# Altium project TIDA-PowerNBIoT.PrjPcb (part 1 of 2)
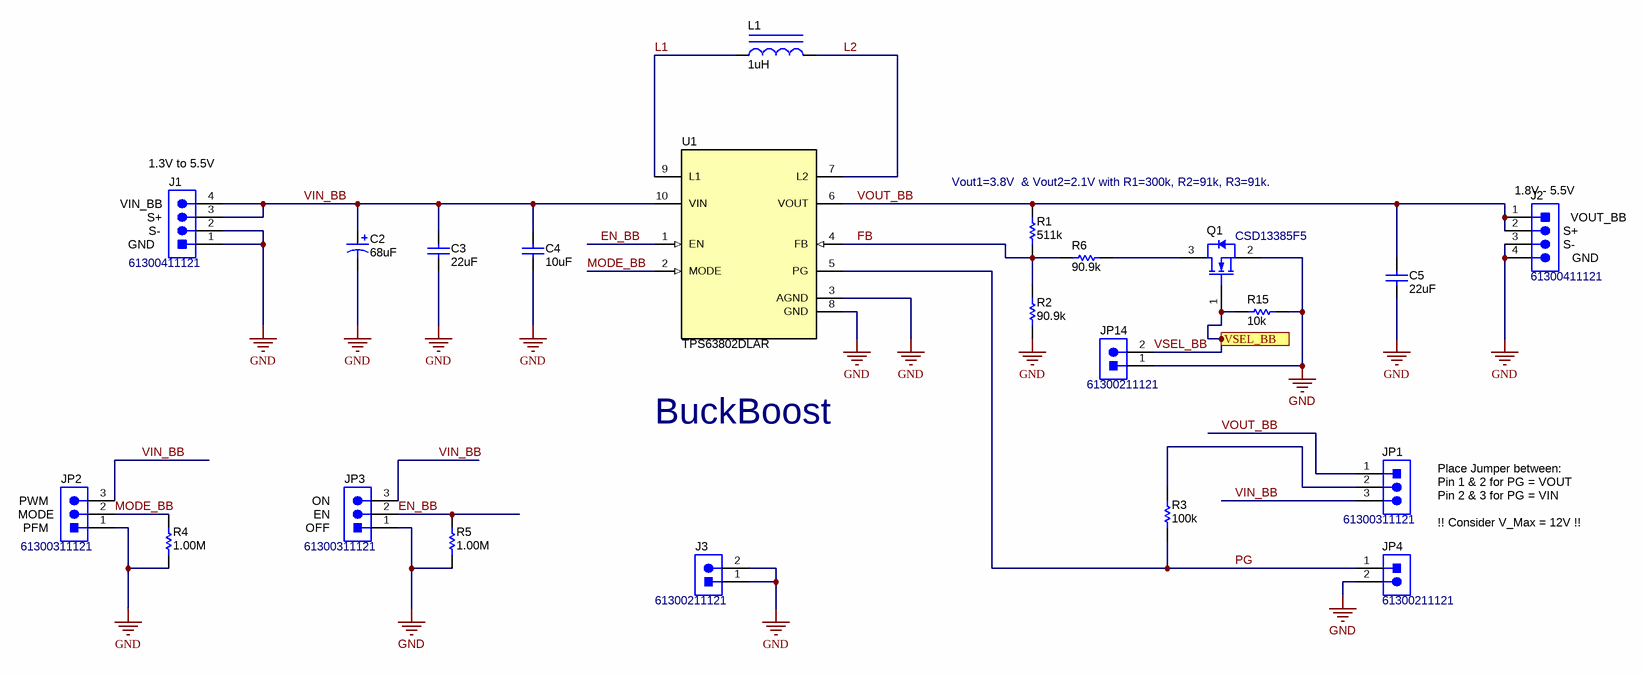
[diagram p0: TIDA-PowerNB_BuckBoost.SchDoc]
CopyrightYear: 2018; EVM_orderable: shippable; EVM_Sheet Title: 12; PCB_Layout: a0797195; PCB_Rev: E1; PRJ_Customer: Public Release; PRJ_Engineer: MGS; PRJ_Number: TIDA-010053; PRJ_Title: TIDA-PowerNBIoT; SCH_Rev: E1; Size: A; TechSupport: http://www.ti.com/support; TID: TIDA-010053
5 sheets, 83 parts. Net scope: flat (ports and power ports of the same name join across sheets).
Board file: TIDA-PowerNBIoT_PCB.PcbDoc
Sheets:
  TIDA-PowerNB_BuckBoost.SchDoc
  TIDA-PowerNBIoT_Buck.SchDoc
  TIDA-PowerNBIoT_CoverSheet.SchDoc
  TIDA-PowerNBIoT_Boost.SchDoc
  TIDA-PowerNBIoT_EVM_Hardware.SchDoc

## Sheet TIDA-PowerNB_BuckBoost.SchDoc
size A3; Date: Not shown in title block; ApprovedBy: Not shown in title block; CheckedBy: Not shown in title block; Author: Not shown in title block; CompanyName: Not shown in title block; DrawnBy: Julian Hagedorn; Engineer: Not shown in title block; Organization: Not shown in title block; Address1: Not shown in title block; Address2: Not shown in title block; Address3: Not shown in title block; Address4: Not shown in title block; DocumentNumber: 1; Revision: Use project parameter SCH_Rev; SheetNumber: 1; SheetTotal: 2; PageSetup: Record=PageOptions|CenterHorizontal=True|CenterVertical=True|PrintScale=1.00|XCorrection=1.00|YCorrection=1.00|PrintKind=0|BorderSize=5000000|LeftOffset=0|BottomOffset=0|Orientation=2|PaperLength=1000|PaperWidth=1000|Scale=100|PaperSource=15|PrintQuality=600|MediaType=1|DitherType=10|PaperKind=Letter|PrintScaleMode=1; CurrentTime: Not shown in title block; CurrentDate: Not shown in title block; Time: Not shown in title block; DocumentFullPathAndName: Not shown in title block; DocumentName: Not shown in title block; ModifiedDate: Not shown in title block; ImagePath: Not shown in title block

### Parts
C2  ValueDisplayed: 68uF  [7343-31]  (hidden comment: Cap_Polarized)
C3  ValueDisplayed: 22uF  [1206_190]  (hidden comment: Capacitor)
C4  ValueDisplayed: 10uF  [0603S]  (hidden comment: Capacitor)
C5  ValueDisplayed: 22uF  [0603S]  (hidden comment: Capacitor)
J1  61300411121  [WURTH_61300411121]
J2  61300411121  [WURTH_61300411121]
J3  61300211121  [WURTH_61300211121]
JP1  61300311121  [WURTH_61300311121]
JP2  61300311121  [WURTH_61300311121]
JP3  61300311121  [WURTH_61300311121]
JP4  61300211121  [WURTH_61300211121]
JP14  61300211121  [WURTH_61300211121]
L1  ValueDisplayed: 1uH  [WE-MAPI_4020]  (hidden comment: 74438356010)
Q1  CSD13385F5  [YJK0003A]
R1  ValueDisplayed: 511k  [0402]  (hidden comment: CRCW0402511KFKED)
R2  ValueDisplayed: 90.9k  [0402]  (hidden comment: CRCW040290K9FKED)
R3  ValueDisplayed: 100k  [0402]  (hidden comment: RC0402FR-07100KL)
R4  ValueDisplayed: 1.00M  [0402]  (hidden comment: CRCW04021M00FKED)
R5  ValueDisplayed: 1.00M  [0402]  (hidden comment: CRCW04021M00FKED)
R6  ValueDisplayed: 90.9k  [0402]  (hidden comment: CRCW040290K9FKED)
R15  Res_ohm: 10k  [0402]  (hidden comment: ERJ-2RKF1002X)
U1  TPS63802DLAR  [DLA0010A]

### Ports
VSEL_BB

### Nets
GND: C2.2(-) C3.2 C4.2 C5.2 J1.1 J1.2 J2.3 J2.4 J3.1 J3.2 JP2.1 JP3.1 JP4.2 JP14.1 Q1.2(S) R2.1 R4.1 R5.1 R15.1 U1.3(AGND) U1.8(GND)
EN_BB: JP3.2 R5.2 U1.1(EN)
FB: R1.1 R2.2 R6.2 U1.4(FB)
L1: L1.1 U1.9(L1)
L2: L1.2 U1.7(L2)
MODE_BB: JP2.2 R4.2 U1.2(MODE)
PG: JP4.1 R3.1 U1.5(PG)
VIN_BB: C2.1(+) C3.1 C4.1 J1.3 J1.4 JP1.3 JP2.3 JP3.3 U1.10(VIN)
VOUT_BB: C5.1 J2.1 J2.2 JP1.1 R1.2 U1.6(VOUT)
VSEL_BB: JP14.2 Q1.1(G) R15.2 ; port VSEL_BB
NetJP1_2: JP1.2 R3.2
NetQ1_3: Q1.3(D) R6.1

### Notes on the sheet
- (near J1) 1.3V to 5.5V
- (near J1) VIN_BB
- (near J1) S+
- (near J1) S-
- (near R1) Vout1=3.8V  & Vout2=2.1V with R1=300k, R2=91k, R3=91k.
- (near J2) 1.8V - 5.5V
- (near J2) S+
- (near J2) VOUT_BB
- (near J1) GND
- (near J2) S-
- (near J2) GND
- BuckBoost
- (near JP2) PWM
- (near JP3) ON
- (near JP2) PFM
- (near JP2) MODE
- (near JP3) OFF
- (near JP3) EN
- Place Jumper between:
  Pin 1 & 2 for PG = VOUT
  Pin 2 & 3 for PG = VIN
  !! Consider V_Max = 12V !!
- Drawn By:
- SVN Rev:
- Number:
- TID #:
- Orderable:
- Rev:
- Sheet Title:
- File:
- Project Title:
- Designed for:
- Assembly Variant:
- Mod. Date:
- Sheet:
- Size:
- of
- A3
- http://www.ti.com
- Texas Instruments and/or its licensors do not warrant the accuracy or completeness of this specification or any information contained therein. Texas Instruments and/or its licensors do not warrant that this design will meet the specifications, will be suitable for your application or fit for any particular purpose, or will operate in an implementation. Texas Instruments and/or its licensors do not warrant that the design is production worthy. You should completely validate and test your design implementation to confirm the system functionality for your application.
- Engineer:
- Contact:
- © Texas Instruments

### Library data of the parts
C2 = CMP-0011790-2: CAP, TA, 68 uF, 20 V, +/- 10%, 0.15 ohm, SMD; PartNumber: T495D686K020ATE150; Manufacturer: Kemet; Polarized: Y; CompType: Capacitor; Value: 68uF; U/M: EA; Cap_F: 68µF; VDC_V: 20V; ESR_ohm: 1.5d; IRMS_A: 9dA; TaMin_C: -55°C; TaMax_C: 125°C; Cap_Case: D; AEC Category: Q200; SizeArea_mm2: 31.39; SizeAreaWB_mm2: 58.59; SizeX_mm: 7.3; SizeY_mm: 4.3; SizeZ_mm: 3.1; PackageReference: 7343-31; RoHS: Y; Tolerance_%: 10%; Value1: 0.15 ohm; Value2: 20V; MountType: SMT; Technology: TA; Series: T495; Publisher: Texas Instruments; LatestRevisionDate: 2017-03-09; LatestRevisionNote: Updated supplier links; ComponentLink1Description: Datasheet link; ComponentLink1URL: http://www.kemet.com/Lists/ProductCatalog/Attachments/261/KEM_T2009_T495.pdf; Supplier 1: Digi-Key; Supplier Part Number 1: 399-3890-1-ND; Supplier 2: Newark; Supplier Part Number 2: 40K1101; Supplier 3: Mouser; Supplier Part Number 3: 80-T495D686K20ATE150; AEC Qualified: ?
C3 = CMP-0009024-2: CAP, CERM, 22 uF, 25 V, +/- 20%, X5R, 1206_190; PartNumber: TMK316BBJ226ML-T; Manufacturer: Taiyo Yuden; Polarized: N; Value: 22uF; U/M: EA; Cap_F: 22µF; Value1: Unknown; VDC_V: 25V; TaMin_C: -55°C; TaMax_C: 85°C; Cap_Case: 1206; AEC Category: Q200; SizeArea_mm2: 5.12; SizeAreaWB_mm2: 10.92; SizeX_mm: 3.2; SizeY_mm: 1.6; SizeZ_mm: 1.9; CompType: Capacitor; PackageReference: 1206_190; RoHS: Y; Tolerance_%: 20%; Value2: 25V; MountType: SMT; Technology: Ceramic; TempCo: X5R; Published: 2008-06-19; Publisher: Texas Instruments; LatestRevisionDate: 2017-03-09; ComponentLink1Description: Datasheet link; ComponentLink1URL: http://www.yuden.co.jp/productdata/catalog/en/mlcc_all_e.pdf; Supplier 1: Digi-Key; Supplier Part Number 1: 587-3246-1-ND; Supplier 2: Newark; Supplier Part Number 2: 29X1397; Supplier 3: Mouser; Supplier Part Number 3: 963-TMK316BBJ226ML-T; AEC Grade: N/A; AEC Qualified: N
C4 = CMP-0007304-5: CAP, CERM, 10 uF, 6.3 V, +/- 20%, X5R, 0603; PartNumber: GRM188R60J106ME84; Manufacturer: MuRata; Polarized: N; Value: 10uF; U/M: EA; Cap_F: 10µF; Value1: Unknown; VDC_V: 6.3V; TaMin_C: -55°C; TaMax_C: 85°C; Cap_Case: 0603; SizeArea_mm2: 1.28; SizeAreaWB_mm2: 4.68; SizeX_mm: 1.6; SizeY_mm: 0.8; SizeZ_mm: 1; AEC Category: Q200; CompType: Capacitor; PackageReference: 0603; RoHS: Y; Tolerance_%: 20%; Value2: 6.3V; MountType: SMT; Technology: Ceramic; TempCo: X5R; Published: 2008-06-19; Publisher: Texas Instruments; LatestRevisionDate: 2017-03-09; ComponentLink1Description: Datasheet link; ComponentLink1URL: http://search.murata.co.jp/Ceramy/image/img/A01X/G101/ENG/GRM188R60J106ME84-01.pdf; Supplier 1: Digi-Key; Supplier Part Number 1: 490-7316-1-ND; AEC Qualified: ?
C5 = CMP-0007306-5: CAP, CERM, 22 uF, 6.3 V, +/- 20%, X5R, 0603; PartNumber: GRM188R60J226MEA0D; Manufacturer: MuRata; Polarized: N; Value: 22uF; U/M: EA; Cap_F: 22µF; Value1: Unknown; VDC_V: 6.3V; TaMin_C: -55°C; TaMax_C: 85°C; Cap_Case: 0603; SizeArea_mm2: 1.28; SizeAreaWB_mm2: 4.68; SizeX_mm: 1.6; SizeY_mm: 0.8; SizeZ_mm: 1; AEC Category: Q200; CompType: Capacitor; PackageReference: 0603; RoHS: Y; Tolerance_%: 20%; Value2: 6.3V; MountType: SMT; Technology: Ceramic; TempCo: X5R; Published: 2008-06-19; Publisher: Texas Instruments; LatestRevisionDate: 2017-03-09; ComponentLink1Description: Datasheet link; ComponentLink1URL: http://search.murata.co.jp/Ceramy/image/img/A01X/G101/ENG/GRM188R60J226MEA0-01.pdf; Supplier 1: Digi-Key; Supplier Part Number 1: 490-7611-1-ND; Supplier 2: Newark; Supplier Part Number 2: 55Y9854; Supplier 3: Mouser; Supplier Part Number 3: 81-GRM188R60J226ME0D; AEC Qualified: N; AEC Grade: N/A
J1 J2 = CMP-0054798-2: Header, 2.54 mm, 4x1, Gold, TH; Manufacturer: Wurth Elektronik; Pitch_mm: 2.54; Gender: Male; Row_Count: 1; Cert_UL: Y; Shrouded: N; Supplier Part Number 3: 2356155; ClassName: Header; MountType: TH; ComponentLink1Description: Datasheet URL; PartNumber: 61300411121; PackageReference: Header, 2.54mm, 4x1, TH; Color: Black; Supplier 3: Farnell; Supplier Part Number 1: 732-5317-ND; Supplier 2: Newark; ComponentLink1URL: http://katalog.we-online.de/em/datasheet/6130xx11121.pdf; CompType: Header; PinCount: 4; Supplier 1: Digi-Key; RoHS: Y; ContactFinish: Gold; Supplier Part Number 2: 20X0951; Orientation: Vertical
J3 JP4 JP14 = CMP-0054794-2: Header, 2.54 mm, 2x1, Gold, TH; Manufacturer: Wurth Elektronik; Shrouded: N; Gender: Male; Green_REACh: Passed; Pitch_mm: 2.54; Green_Lifecycle: Active; Row_Count: 1; Cert_UL: Y; Supplier Part Number 2: 20X0948; Orientation: Vertical; PinCount: 2; ClassName: Header; Supplier 2: Newark; PackageReference: Header, 2.54mm, 2x1, TH; CompType: Header; ComponentLink1Description: Datasheet URL; Supplier 1: Digi-Key; Green_EU RoHS-2: Incomplete; ComponentLink1URL: http://katalog.we-online.de/em/datasheet/6130xx11121.pdf; Green_EU RoHS: Passed; MountType: TH; Supplier Part Number 3: 710-61300211121; RoHS: Y; Supplier Part Number 1: 732-5315-ND; ContactFinish: Gold; Supplier 3: Mouser; PartNumber: 61300211121; Color: Black
JP1-JP3 = CMP-0054796-2: Header, 2.54 mm, 3x1, Gold, TH; Manufacturer: Wurth Elektronik; Pitch_mm: 2.54; Green_Lifecycle: Active; Cert_UL: Y; Shrouded: N; Green_REACh: Passed; Gender: Male; Row_Count: 1; MountType: TH; Supplier Part Number 1: 732-5316-ND; PinCount: 3; Color: Black; ClassName: Header; Supplier Part Number 3: 356154; ContactFinish: Gold; ComponentLink1Description: Datasheet URL; ComponentLink1URL: http://katalog.we-online.de/em/datasheet/6130xx11121.pdf; PackageReference: Header, 2.54mm, 3x1, TH; Supplier Part Number 2: 20X0950; Green_EU RoHS-2: Incomplete; CompType: Header; Green_EU RoHS: Passed; Orientation: Vertical; RoHS: Y; PartNumber: 61300311121; Supplier 2: Newark; Supplier 1: Digi-Key; Supplier 3: Farnell
L1 = CMP-0064168-1: Inductor, Shielded, 1 uH, 7.2 A, 0.012 ohm, SMD; Manufacturer: Wurth Elektronik; Isat: 9A @ 20% inductance drop; Irms: 7.2A @ 40C rise; Green_Lifecycle: Active; SizeAreaWB_mm2: 26.01; DCR_ohm: 0.012; Green_REACh: Passed; Value: 1uH; Imax_A: 7.2A; SizeZ_mm: 2.1; SizeX_mm: 4.1; SizeArea_mm2: 16.81; Ind_H: 1µH; AEC Qualified: N; AEC Category: Q200; ComponentLink1URL: https://sps06.itg.ti.com/sites/KMS/crossdivteams/altium/docs/ComponentDatasheets/74438356010 Wurth.pdf; Publisher: Texas Instruments; Published: 2008-06-26; RoHS: Y; Value1: 0.012 ohm; Material: ?; MountType: SMT; Green_EU RoHS-2: Incomplete; Green_EU RoHS: Passed; PackageReference: 4.1x4.1mm; SizeY_mm: 4.1; Value2: 7.2A; CompType: Inductor; LatestRevisionDate: 2017-06-02; PartNumber: 74438356010; ComponentLink1Description: Datasheet link; AEC Grade: N/A; Technology: Shielded
Q1 = CMP-0080799-1: MOSFET, N-CH, 12 V, 4.3 A, YJK0003A (PICOSTAR-3); Alternate Manufacturer: None; Manufacturer: Texas Instruments; Rdson45_ohm: 0.019; QgTyp_nC: 3.9; SizeAreaWB_mm2: 4.3077; Vgs_V: 8V; Value1: 0.019 ohm; VdsMax_V: 12V; Value: 12V; IdsMax_A: 4.3A; SizeZ_mm: 0.35; SizeX_mm: 1.49; SizeY_mm: 0.73; Value2: 3.9 nC; SizeArea_mm2: 1.0877; ChType: N; AEC Category: Q101; ComponentLink1URL: http://www.ti.com/lit/ds/symlink/csd13385f5.pdf; Supplier Part Number 2: 595-CSD13385F5; Supplier 2: Mouser; RoHS: Y; MountType: SMT; Supplier 1: Digi-Key; PackageReference: YJK0003A; CompType: MOSFET; PartNumber: CSD13385F5; AEC Qualified: N; ComponentLink1Description: Datasheet link; Supplier Part Number 1: 296-47751-1-ND
R1 = CMP-0026435-2: RES, 511 k, 1%, 0.063 W, AEC-Q200 Grade 0, 0402; Manufacturer: Vishay-Dale; Power_W: 63mW; TempCo: 100 ppm/C; Value: 511k; EIA_Code: E96; SizeX_mm: 1; SizeY_mm: 0.5; SizeZ_mm: 0.6; Value2: 0.063W; AEC Qualified: Y; VDC_V: 50V; AEC Category: Q200; AEC Grade: 0; ComponentLink1URL: http://www.vishay.com/docs/20035/dcrcwe3.pdf; Supplier Part Number 2: 52K7134; Supplier 2: Newark; Supplier Part Number 3: 71-CRCW0402-511K-E3; Supplier 3: Mouser; Value_Code: 511k; RoHS: E; Value1: 1%; MountType: SMT; Supplier 1: Digi-Key; PackageReference: 0402; Tolerance_%: 1%; Res_ohm: 511k; SizeArea_mm2: 0.5; CompType: Resistor; PartNumber: CRCW0402511KFKED; ComponentLink1Description: Datasheet link; Supplier Part Number 1: 541-511KLCT-ND; Technology: Thick Film
R2 R6 = CMP-0026605-2: RES, 90.9 k, 1%, 0.063 W, AEC-Q200 Grade 0, 0402; Manufacturer: Vishay-Dale; Power_W: 63mW; TempCo: 100 ppm/C; Value_Code: 90k9; Value: 90.9k; EIA_Code: E96; SizeX_mm: 1; SizeY_mm: 0.5; SizeZ_mm: 0.6; Value2: 0.063W; AEC Qualified: Y; VDC_V: 50V; AEC Category: Q200; AEC Grade: 0; ComponentLink1URL: http://www.vishay.com/docs/20035/dcrcwe3.pdf; Supplier Part Number 2: 52K7338; Supplier 2: Newark; Supplier Part Number 3: 71-CRCW0402-90.9K-E3; Supplier 3: Mouser; RoHS: E; Value1: 1%; MountType: SMT; Supplier 1: Digi-Key; PackageReference: 0402; Tolerance_%: 1%; Res_ohm: 90.9k; SizeArea_mm2: 0.5; CompType: Resistor; PartNumber: CRCW040290K9FKED; ComponentLink1Description: Datasheet link; Supplier Part Number 1: 541-90.9KLCT-ND; Technology: Thick Film
R3 = CMP-0026721-1: RES, 100 k, 1%, 0.0625 W, 0402; Manufacturer: Yageo America; Power_W: 62.5mW; TempCo: 100 ppm/C; U/M: EA; Value: 100k; EIA_Code: E96; SizeX_mm: 1; SizeY_mm: 0.5; SizeZ_mm: 0.6; AEC Qualified: N; VDC_V: 50V; AEC Category: Q200; ComponentLink1URL: http://www.yageo.com/documents/recent/PYu-RC0402_51_RoHS_L_6_r.pdf; Supplier Part Number 2: 67R9887; Publisher: Texas Instruments; Supplier 2: Newark; Supplier Part Number 3: 603-RC0402FR-07100KL; Supplier 3: Mouser; Published: 2008-06-26; Value_Code: 100k; RoHS: Y; Value1: 1%; MountType: SMT; Supplier 1: Digi-Key; PackageReference: 0402; Tolerance_%: 1%; Res_ohm: 100k; Value2: 0.0625W; SizeArea_mm2: 0.5; CompType: Resistor; LatestRevisionDate: 2017-03-09; PartNumber: RC0402FR-07100KL; ComponentLink1Description: Datasheet link; AEC Grade: N/A; Supplier Part Number 1: 311-100KLRCT-ND; Technology: Thick Film
R4 R5 = CMP-0026100-2: RES, 1.00 M, 1%, 0.063 W, AEC-Q200 Grade 0, 0402; Manufacturer: Vishay-Dale; Power_W: 63mW; TempCo: 100 ppm/C; Value_Code: 1M00; Value: 1.00Meg; EIA_Code: E96; Res_ohm: 1M; SizeX_mm: 1; SizeY_mm: 0.5; SizeZ_mm: 0.6; Value2: 0.063W; AEC Qualified: Y; VDC_V: 50V; AEC Category: Q200; AEC Grade: 0; ComponentLink1URL: http://www.vishay.com/docs/20035/dcrcwe3.pdf; Supplier Part Number 2: 52K6593; Supplier 2: Newark; Supplier Part Number 3: 71-CRCW0402-1.0M-E3; Supplier 3: Mouser; RoHS: E; Value1: 1%; MountType: SMT; Supplier 1: Digi-Key; PackageReference: 0402; Tolerance_%: 1%; SizeArea_mm2: 0.5; CompType: Resistor; PartNumber: CRCW04021M00FKED; ComponentLink1Description: Datasheet link; Supplier Part Number 1: 541-1.00MLCT-ND; Technology: Thick Film
R15 = CMP-0026658-1: RES, 10.0 k, 1%, 0.1 W, 0402; Manufacturer: Panasonic; Power_W: 100mW; TempCo: 100 ppm/C; Value_Code: 10k0; U/M: EA; Value: 10.0k; EIA_Code: E96; SizeX_mm: 1; SizeY_mm: 0.5; SizeZ_mm: 0.6; Value2: 0.1W; CompType: Resistor; VDC_V: 50V; AEC Category: Q200; ComponentLink1URL: http://industrial.panasonic.com/www-data/pdf/AOA0000/AOA0000CE2.pdf; Supplier Part Number 2: 90W2949; Publisher: Texas Instruments; Supplier 2: Newark; Supplier Part Number 3: 667-ERJ-2RKF1002X; Supplier 3: Mouser; Published: 2008-06-26; RoHS: Y; Value1: 1%; MountType: SMT; Supplier 1: Digi-Key; PackageReference: 0402; Tolerance_%: 1%; SizeArea_mm2: 0.5; LatestRevisionDate: 2017-03-09; PartNumber: ERJ-2RKF1002X; AEC Qualified: ?; ComponentLink1Description: Datasheet link; Supplier Part Number 1: P10.0KLCT-ND; Technology: Thick Film; ValueDisplayed: 10.0k
U1 = CMP-0076712-3: High Current, High Efficiency Single Inductor Buck-Boost Converter, DLA0010A (VQFN-HR-10); Manufacturer: Texas Instruments; Alternate PartNumber: TPS63802DLAT; SizeX_mm: 2.0; SizeY_mm: 3.0; CompType: IC; SizeZ_mm: 1.0; SizeArea_mm2: 6.0; SizeAreaWB_mm2: 12.0; U/M: EA; PackageDescription: VQFN-HR-10; PartNumber: TPS63802DLAR; ComponentLink1URL: https://sps06.itg.ti.com/sites/KMS/crossdivteams/altium/docs/ComponentDatasheets/TPS63802_pinout.PNG; ComponentLink1Description: Datasheet Link; LatestRevisionDate: 2017-07-18; Publisher: Texas Instruments; PackageReference: DLA0010A; MountType: SMT; Alternate Manufacturer: Texas Instruments

## Sheet TIDA-PowerNBIoT_Buck.SchDoc
size 431 x 279 mm; Date: Not shown in title block; ApprovedBy: Not shown in title block; CheckedBy: Not shown in title block; Author: Not shown in title block; CompanyName: Not shown in title block; DrawnBy: Chris Glaser; Engineer: Not shown in title block; Organization: Not shown in title block; Address1: Not shown in title block; Address2: Not shown in title block; Address3: Not shown in title block; Address4: Not shown in title block; DocumentNumber: 1; Revision: Use project parameter SCH_Rev; SheetNumber: 1; SheetTotal: 2; PageSetup: Record=PageOptions|CenterHorizontal=True|CenterVertical=True|PrintScale=1.00|XCorrection=1.00|YCorrection=1.00|PrintKind=0|BorderSize=5000000|LeftOffset=0|BottomOffset=0|Orientation=2|PaperLength=1000|PaperWidth=1000|Scale=100|PaperSource=15|PrintQuality=600|MediaType=1|DitherType=10|PaperKind=Letter|PrintScaleMode=1; CurrentTime: Not shown in title block; CurrentDate: Not shown in title block; Time: Not shown in title block; DocumentFullPathAndName: Not shown in title block; DocumentName: Not shown in title block; ModifiedDate: Not shown in title block; ImagePath: Not shown in title block
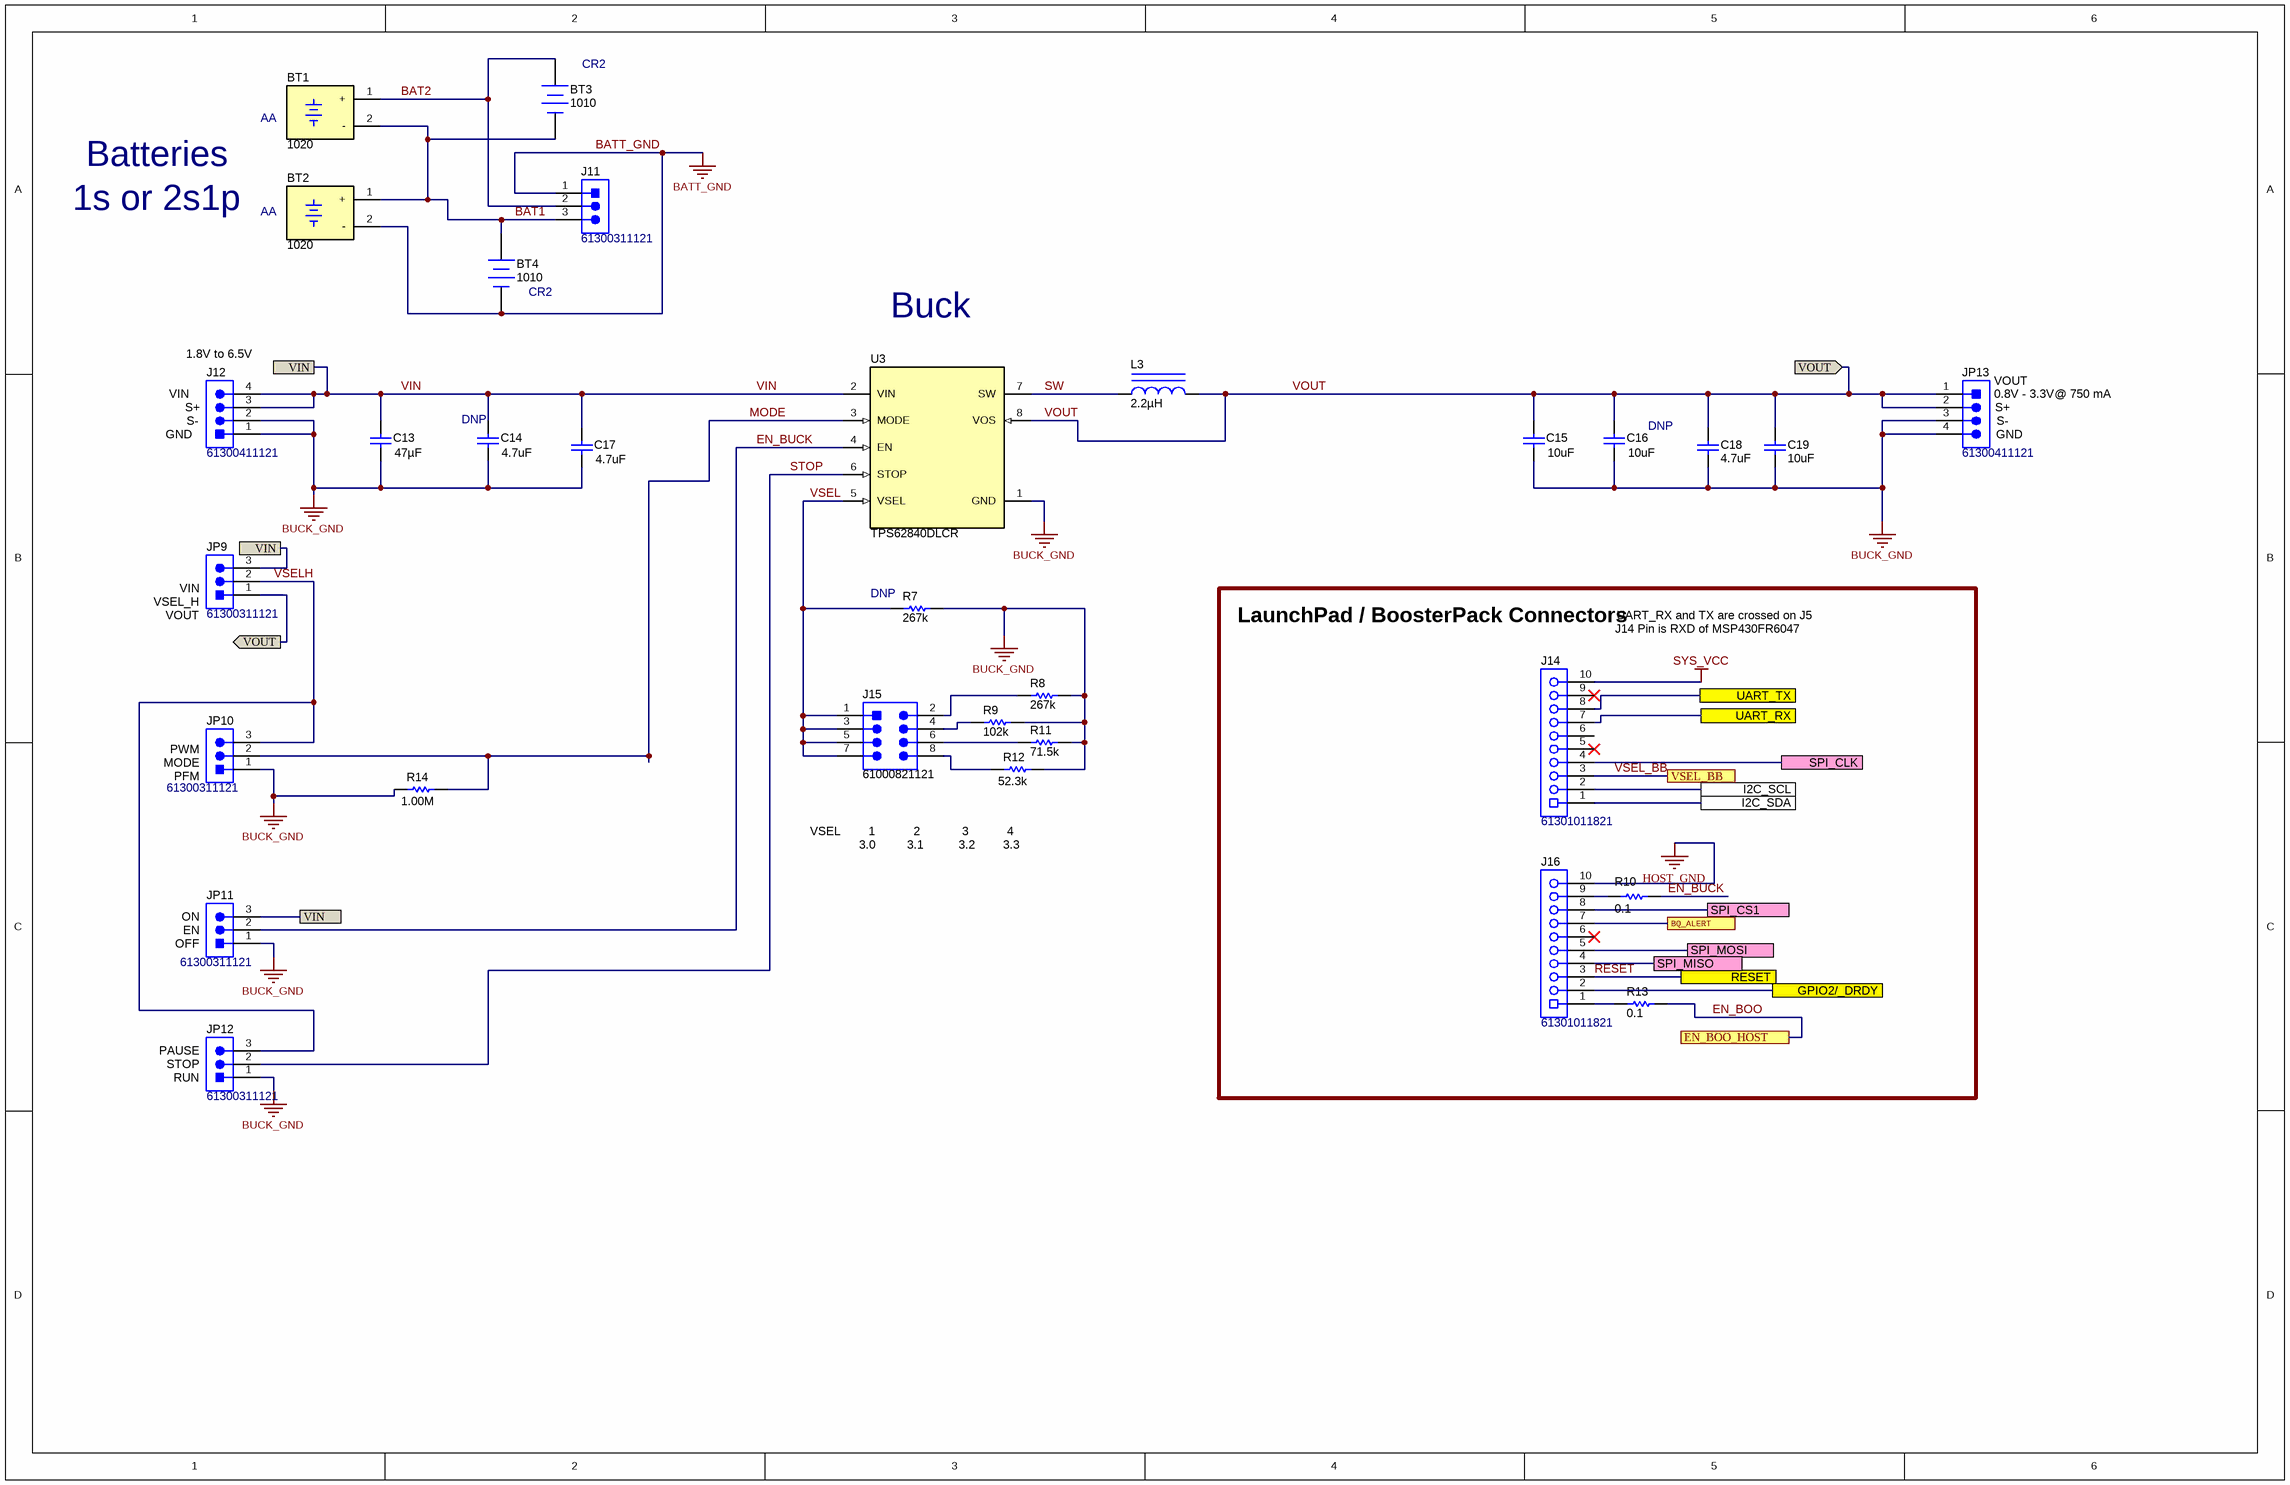
[diagram p1: TIDA-PowerNBIoT_Buck.SchDoc]

### Parts
BT1  1020  [Keystone_1020]
BT2  1020  [Keystone_1020]
BT3  1010  [BAT_1010]
BT4  1010  [BAT_1010]
C13  ValueDisplayed: 47µF  [0805_HV]  (hidden comment: GRM21BR61A476ME15L)
C14  ValueDisplayed: 4.7uF  [0402S]  (hidden comment: GRM155R61A475MEAAD)
C15  ValueDisplayed: 10uF  [0402_070]  (hidden comment: GRM155R60G106ME44D)
C16  ValueDisplayed: 10uF  [0402_070]  (hidden comment: GRM155R60G106ME44D)
C17  ValueDisplayed: 4.7uF  [0402S]  (hidden comment: GRM155R61A475MEAAD)
C18  ValueDisplayed: 4.7uF  [0603S]  (hidden comment: GRM188R60J475ME19D)
C19  ValueDisplayed: 10uF  [0805_HV]  (hidden comment: GRM21BR70J106KE76L)
J11  61300311121  [WURTH_61300311121]
J12  61300411121  [WURTH_61300411121]
J14  61301011821  [Wurth_61301011821]
J15  61000821121  [Wurth_61000821121]
J16  61301011821  [Wurth_61301011821]
JP9  61300311121  [WURTH_61300311121]
JP10  61300311121  [WURTH_61300311121]
JP11  61300311121  [WURTH_61300311121]
JP12  61300311121  [WURTH_61300311121]
JP13  61300411121  [WURTH_61300411121]
L3  ValueDisplayed: 2.2µH  [DFE201612E]  (hidden comment: DFE201612E-2R2M=P2)
R7  ValueDisplayed: 267k  [0402]  (hidden comment: ERJ-2RKF2673X)
R8  ValueDisplayed: 267k  [0402]  (hidden comment: ERJ-2RKF2673X)
R9  ValueDisplayed: 102k  [0402]  (hidden comment: CRCW0402102KFKED)
R10  ValueDisplayed: 0.1  [0402]  (hidden comment: ERJ-2BSFR10X)
R11  ValueDisplayed: 71.5k  [0402]  (hidden comment: CRCW040271K5FKED)
R12  ValueDisplayed: 52.3k  [0402]  (hidden comment: CRCW040252K3FKED)
R13  ValueDisplayed: 0.1  [0402]  (hidden comment: ERJ-2BSFR10X)
R14  ValueDisplayed: 1.00M  [0402]  (hidden comment: CRCW04021M00FKED)
U3  TPS62840DLCR  [DLC0008B]

### Blocks framed on the sheet
LaunchPad / BoosterPack Connectors: J14 J16 R10 R13

### Ports
BQ_ALERT, EN_BOO_HOST, GPIO2/_DRDY, I2C_SCL, I2C_SDA, RESET, SPI_CLK, SPI_CS1, SPI_MISO, SPI_MOSI, UART_RX, UART_TX, VIN, VOUT (in), VOUT (out), VSEL_BB

### Nets
BATT_GND: BT2.2(-) BT4.2(-) J11.1
BUCK_GND: C13.2 C14.2 C15.2 C16.2 C17.2 C18.2 C19.2 J12.1 J12.2 JP10.1 JP11.1 JP12.1 JP13.3 JP13.4 R7.2 R8.2 R9.2 R11.2 R12.2 R14.1 U3.1(GND)
HOST_GND: J16.10
SYS_VCC: J14.10
BAT1: BT1.2(-) BT2.1(+) BT3.2(-) BT4.1(+) J11.3
BAT2: BT1.1(+) BT3.1(+) J11.2
BQ_ALERT: J16.7 ; port BQ_ALERT
EN_BOO: R13.2 ; port EN_BOO_HOST
EN_BUCK: JP11.2 R10.2 U3.4(EN)
GPIO2/_DRDY: J16.2 ; port GPIO2/_DRDY
I2C_SCL: J14.2 ; port I2C_SCL
I2C_SDA: J14.1 ; port I2C_SDA
MODE: JP10.2 R14.2 U3.3(MODE)
RESET: J16.3 ; port RESET
SPI_CLK: J14.4 ; port SPI_CLK
SPI_CS1: J16.8 ; port SPI_CS1
SPI_MISO: J16.4 ; port SPI_MISO
SPI_MOSI: J16.5 ; port SPI_MOSI
STOP: JP12.2 U3.6(STOP)
SW: L3.1 U3.7(SW)
UART_RX: J14.7 ; port UART_RX
UART_TX: J14.8 ; port UART_TX
VIN: C13.1 C14.1 C17.1 J12.3 J12.4 JP9.3 JP11.3 U3.2(VIN) ; port VIN
VOUT: C15.1 C16.1 C18.1 C19.1 JP9.1 JP13.1 JP13.2 L3.2 U3.8(VOS) ; port VOUT
VSEL: J15.1 J15.3 J15.5 J15.7 R7.1 U3.5(VSEL)
VSEL_BB: J14.3 ; port VSEL_BB
VSELH: JP9.2 JP10.3 JP12.3
NetJ15_2: J15.2 R8.1
NetJ15_4: J15.4 R9.1
NetJ15_6: J15.6 R11.1
NetJ15_8: J15.8 R12.1
NetJ16_1: J16.1 R13.1
NetJ16_9: J16.9 R10.1

Not connected (* = marked no-connect by the designer): J14 5* 6 9*; J16 6*

### Notes on the sheet
- (near BT3) CR2
- AA
- 1s or 2s1p
- Batteries
- (near BT4) CR2
- (near J12) 1.8V to 6.5V
- Buck
- (near J12) VIN
- (near J12) GND
- (near J12) S+
- (near J12) S-
- (near C14) DNP
- DNP
- (near JP13) S+
- (near JP13) S-
- (near JP13) GND
- (near JP13) VOUT
- (near JP13) 0.8V - 3.3V
- @ 750 mA
- (near JP9) VSEL_H
- (near JP9) VOUT
- (near JP9) VIN
- (near R7) DNP
- J14 Pin is RXD of MSP430FR6047
- UART_RX and TX are crossed on J5
- (near JP10) MODE
- (near JP10) PWM
- (near JP10) PFM
- VSEL        1           2            3           4
  3.0         3.1          3.2        3.3
- (near JP11) OFF
- (near JP11) ON
- (near JP11) EN
- (near JP12) PAUSE
- (near JP12) STOP
- (near JP12) RUN
- Drawn By:
- SVN Rev:
- Number:
- TID #:
- Orderable:
- Rev:
- Sheet Title:
- File:
- Project Title:
- Designed for:
- Assembly Variant:
- Mod. Date:
- Sheet:
- Size:
- of
- B
- http://www.ti.com
- Texas Instruments and/or its licensors do not warrant the accuracy or completeness of this specification or any information contained therein. Texas Instruments and/or its licensors do not warrant that this design will meet the specifications, will be suitable for your application or fit for any particular purpose, or will operate in an implementation. Texas Instruments and/or its licensors do not warrant that the design is production worthy. You should completely validate and test your design implementation to confirm the system functionality for your application.
- Engineer:
- Contact:
- © Texas Instruments

### Library data of the parts
BT1 BT2 = CMP-0003908-1: HOLDER BATTERY AAA, SMT; Manufacturer: Keystone; CompType: Battery Holder; ComponentLink1URL: http://www.keyelco.com/product-pdf.cfm?p=934; Key: 1020; Publisher: Texas Instruments; Supplier Part Number 2: 57R3959; Supplier 3: Mouser; Supplier 1: Digi-Key; PackageReference: HOLDER BATTERY AAA, SMT; LatestRevisionDate: 2017-03-09; RoHS: Y; Supplier Part Number 1: 36-1020-ND; Supplier Part Number 3: 534-1020; Supplier 2: Newark; MountType: SMT; PartNumber: 1020; ComponentLink1Description: Datasheet Link
BT3 BT4 = CMP-0003630-1: Battery Holder, Nylon, CR2, SMT; Manufacturer: Keystone; ComponentLink1URL: http://www.keyelco.com/userAssets/store/files/1010.pdf; Key: 1010; Publisher: Texas Instruments; Supplier Part Number 2: 534-1010; Supplier 1: Digi-Key; CompType: Battery Holder; PackageReference: Battery holder; LatestRevisionDate: 2017-03-09; RoHS: Y; Supplier Part Number 1: 36-1010-ND; MountType: SMT; Supplier 2: Mouser; PartNumber: 1010; ComponentLink1Description: Datasheet Link
C13 = CMP-0078699-1: CAP, CERM, 47 µF, 10 V,+/- 20%, X5R, 0805; Manufacturer: MuRata; TaMin_C: -55°C; Polarized: N; Green_Lifecycle: Active; SizeAreaWB_mm2: 6.75; Green_REACh: Passed; U/M: EA; Value: 47uF; TaMax_C: 85°C; SizeZ_mm: 1.45; SizeX_mm: 2; SizeY_mm: 1.25; Cap_Case: 0805; Value2: 10V; SizeArea_mm2: 2.5; CompType: Capacitor; AEC Category: Q200; ComponentLink1URL: http://search.murata.co.jp/Ceramy/image/img/A01X/G101/ENG/GRM21BR61A476ME15-01.pdf; Supplier Part Number 2: 96Y9273; Supplier 2: Newark; Supplier Part Number 3: 81-GRM21BR61A476ME5L; TempCo: X5R; Supplier 3: Mouser; RoHS: Y; MountType: SMT; Green_EU RoHS-2: Incomplete; Supplier 1: Digi-Key; Green_EU RoHS: Passed; PackageReference: 0805; Tolerance_%: 20%; PartNumber: GRM21BR61A476ME15L; AEC Qualified: N; Cap_F: 47µF; VDC_V: 10V; ComponentLink1Description: Datasheet link; AEC Grade: N/A; Supplier Part Number 1: 490-9961-1-ND; Technology: Ceramic
C14 C17 = CMP-0006582-2: CAP, CERM, 4.7 uF, 10 V, +/- 20%, X5R, 0402; Manufacturer: MuRata; TaMin_C: -55°C; Polarized: N; SizeAreaWB_mm2: 3; Value1: Unknown; U/M: EA; Value: 4.7uF; TaMax_C: 85°C; SizeZ_mm: 0.6; SizeX_mm: 1; SizeY_mm: 0.5; Cap_Case: 0402; Value2: 10V; CompType: Capacitor; Cap_F: 4.7µF; AEC Category: Q200; Publisher: Texas Instruments; TempCo: X5R; Published: 2008-06-19; RoHS: Y; MountType: SMT; PackageReference: 0402; Tolerance_%: 20%; SizeArea_mm2: 0.5; LatestRevisionDate: 2017-03-09; PartNumber: GRM155R61A475MEAAD; AEC Qualified: N; VDC_V: 10V; ComponentLink1Description: Datasheet link; AEC Grade: N/A; Technology: Ceramic; ComponentLink1URL: http://search.murata.co.jp/Ceramy/image/img/A01X/G101/ENG/GRM155R61A475MEAA-01.pdf
C15 C16 = CMP-0006528-2: CAP, CERM, 10 uF, 4 V, +/- 20%, X5R, 0402; Manufacturer: MuRata; TaMin_C: -55°C; Polarized: N; SizeAreaWB_mm2: 3; Value1: Unknown; U/M: EA; Value: 10uF; TaMax_C: 85°C; SizeZ_mm: 0.7; SizeX_mm: 1; SizeY_mm: 0.5; Cap_Case: 0402; Value2: 4V; Cap_F: 10µF; AEC Category: Q200; Supplier Part Number 2: 81-GRM155R60G106ME4D; Publisher: Texas Instruments; Supplier 2: Mouser; TempCo: X5R; Published: 2008-06-19; RoHS: Y; MountType: SMT; Supplier 1: Digi-Key; PackageReference: 0402; Tolerance_%: 20%; SizeArea_mm2: 0.5; CompType: Capacitor; LatestRevisionDate: 2017-03-09; PartNumber: GRM155R60G106ME44D; AEC Qualified: N; VDC_V: 4V; ComponentLink1Description: Datasheet link; AEC Grade: N/A; Supplier Part Number 1: GRM155R60G106ME44D-ND; Technology: Ceramic; ComponentLink1URL: http://psearch.murata.com/capacitor/product/GRM155R60G106ME44%23.pdf
C18 = CMP-0007312-5: CAP, CERM, 4.7 uF, 6.3 V, +/- 20%, X5R, 0603; Manufacturer: MuRata; Polarized: N; CompType: Capacitor; Value: 4.7uF; U/M: EA; Cap_F: 4.7µF; ESR_ohm: 1m; Value1: 0.001 ohm; VDC_V: 6.3V; TaMin_C: -55°C; TaMax_C: 85°C; Cap_Case: 0603; SizeArea_mm2: 1.28; SizeAreaWB_mm2: 4.68; SizeX_mm: 1.6; SizeY_mm: 0.8; SizeZ_mm: 1; AEC Category: Q200; PartNumber: GRM188R60J475ME19D; PackageReference: 0603; RoHS: Y; Tolerance_%: 20%; Value2: 6.3V; MountType: SMT; Technology: Ceramic; TempCo: X5R; Published: 2008-06-19; Publisher: Texas Instruments; LatestRevisionDate: 2017-03-09; ComponentLink1Description: Datasheet link; ComponentLink1URL: http://search.murata.co.jp/Ceramy/image/img/PDF/ENG/GRM188R60J475ME19.pdf; Supplier 1: Digi-Key; Supplier Part Number 1: 490-5421-1-ND; Supplier 2: Mouser; Supplier Part Number 2: 81-GRM188R60J475ME9D; AEC Qualified: ?
C19 = CMP-0008311-2: CAP, CERM, 10 uF, 6.3 V, +/- 10%, X7R, 0805; Manufacturer: MuRata; Polarized: N; Value: 10uF; U/M: EA; Cap_F: 10µF; Value1: Unknown; VDC_V: 6.3V; TaMin_C: -55°C; TaMax_C: 125°C; Cap_Case: 0805; SizeArea_mm2: 2.5; SizeAreaWB_mm2: 6.75; SizeX_mm: 2; SizeY_mm: 1.25; SizeZ_mm: 1.45; AEC Category: Q200; CompType: Capacitor; PartNumber: GRM21BR70J106KE76L; PackageReference: 0805; RoHS: Y; Tolerance_%: 10%; Value2: 6.3V; MountType: SMT; Technology: Ceramic; TempCo: X7R; Published: 2008-06-19; Publisher: Texas Instruments; LatestRevisionDate: 2017-03-09; ComponentLink1Description: Datasheet link; ComponentLink1URL: http://search.murata.co.jp/Ceramy/PnsearchViewAction.do?HnOFG=ON&HnNFG=ON&SEL_CNT=50&sLang=en&sKey=GRM21BR70J106KE76L&x=9&y=9&search=startwith; Supplier 1: Digi-Key; Supplier Part Number 1: 490-3904-1-ND; Supplier 2: Mouser; Supplier Part Number 2: 81-GRM21BR70J106KE76; Supplier 3: Farnell; Supplier Part Number 3: 1845768; AEC Qualified: ?
J11 JP9-JP12 = CMP-0054796-2: as JP1 on sheet TIDA-PowerNB_BuckBoost; MountType: TH; Supplier Part Number 1: 732-5316-ND; PinCount: 3; Color: Black; ClassName: Header; Supplier Part Number 3: 356154; ContactFinish: Gold; ComponentLink1Description: Datasheet URL; ComponentLink1URL: http://katalog.we-online.de/em/datasheet/6130xx11121.pdf; PackageReference: Header, 2.54mm, 3x1, TH; Supplier Part Number 2: 20X0950; Green_EU RoHS-2: Incomplete; CompType: Header; Green_EU RoHS: Passed; Orientation: Vertical; RoHS: Y; PartNumber: 61300311121; Supplier 2: Newark; Supplier 1: Digi-Key; Supplier 3: Farnell
J12 JP13 = CMP-0054798-2: as J1 on sheet TIDA-PowerNB_BuckBoost; Supplier Part Number 3: 2356155; ClassName: Header; MountType: TH; ComponentLink1Description: Datasheet URL; PartNumber: 61300411121; PackageReference: Header, 2.54mm, 4x1, TH; Color: Black; Supplier 3: Farnell; Supplier Part Number 1: 732-5317-ND; Supplier 2: Newark; ComponentLink1URL: http://katalog.we-online.de/em/datasheet/6130xx11121.pdf; CompType: Header; PinCount: 4; Supplier 1: Digi-Key; RoHS: Y; ContactFinish: Gold; Supplier Part Number 2: 20X0951; Orientation: Vertical
J14 J16 = CMP-0054762-1: Receptacle, 2.54mm, 10x1, Gold, TH; Manufacturer: Wurth Elektronik; CNHeader: FALSE; Current_A: 3A; Gender: Female; Cert_CSA: Y; Voltage_V: 250V; Row_Count: 1; Pitch_mm: 2.54; ComponentLink1URL: http://katalog.we-online.de/em/datasheet/6130xx11821.pdf; Supplier Part Number 2: 16T0628; Publisher: Texas Instruments; Supplier 2: Newark; Supplier Part Number 3: 710-61301011821; Color: Black; Supplier 3: Mouser; RoHS: Y; MountType: TH; Supplier 1: Digi-Key; PackageReference: Receptacle, 2.54mm, 10x1, TH; PinCount: 10; CompType: Receptacle; LatestRevisionDate: 26/05/2017; PartNumber: 61301011821; Orientation: Vertical; ComponentLink1Description: Datasheet URL; Supplier Part Number 1: 732-2859-ND; ContactFinish: Gold; CT: FALSE
J15 = CMP-0079535-2: Header, 2.54mm, 4x2, Gold, SMT; Manufacturer: Wurth Elektronik; Pitch_mm: 2.54; Gender: Male; Cert_UL: Y; Current_A: 3A; Voltage_V: 250V; Shrouded: N; Row_Count: 2; ComponentLink1Description: Datasheet URL; RoHS: Y; Supplier Part Number 3: 710-61000821121; Supplier 1: Digi-Key; Orientation: Vertical; PackageReference: Header, 2.54mm, 4x2, SMT; Color: Black; PartNumber: 61000821121; PinCount: 8; Supplier Part Number 2: 20X0851; ContactFinish: Gold; Supplier 2: Newark; ClassName: Header; RowSpacing_mm: 2.54; ComponentLink1URL: http://katalog.we-online.de/em/datasheet/6100xx21121.pdf; CompType: Header; MountType: SMT; Supplier Part Number 1: 732-5462-5-ND; Supplier 3: Mouser
L3 = CMP-0080775-1: Inductor, Shielded, Metal Composite, 2.2 µH, 1.8 A, 0.116 ohm, SMD; Manufacturer: MuRata; Isat: 2.4A @ 30% inductance drop; Irms: 1.8A @ 40C rise; SizeAreaWB_mm2: 7.8; DCR_ohm: 1.16d; Value: 2.2uH; Imax_A: 1.8A; SizeZ_mm: 1.2; SizeX_mm: 2; SizeY_mm: 1.6; SizeArea_mm2: 3.2; AEC Qualified: N; AEC Category: Q200; ComponentLink1URL: http://www.murata.com/~/media/webrenewal/products/inductor/chip/tokoproducts/wirewoundmetalalloychiptype/m_dfe201612e.ashx?la=en-us; RoHS: Y; Value1: 0.116 ohm; Material: Metal Composite; MountType: SMT; PackageReference: 2x1.6mm; Value2: 1.8A; CompType: Inductor; Ind_H: 2.2µH; PartNumber: DFE201612E-2R2M=P2; ComponentLink1Description: Datasheet link; AEC Grade: N/A; Technology: Shielded
R7 R8 = CMP-0026690-1: RES, 267 k, 1%, 0.1 W, AEC-Q200 Grade 0, 0402; Manufacturer: Panasonic; Power_W: 100mW; TempCo: 100 ppm/C; U/M: EA; Value: 267k; EIA_Code: E96; SizeX_mm: 1; SizeY_mm: 0.5; SizeZ_mm: 0.6; Value2: 0.1W; AEC Qualified: Y; VDC_V: 50V; AEC Grade: 0; AEC Category: Q200; ComponentLink1URL: http://industrial.panasonic.com/cdbs/www-data/pdf/RDA0000/AOA0000CE2.pdf; Supplier Part Number 2: 53W4303; Publisher: Texas Instruments; Supplier 2: Newark; Supplier Part Number 3: 667-ERJ-2RKF2673X; Supplier 3: Mouser; Published: 2008-06-26; Value_Code: 267k; RoHS: Y; Value1: 1%; MountType: SMT; Supplier 1: Digi-Key; PackageReference: 0402; Tolerance_%: 1%; Res_ohm: 267k; SizeArea_mm2: 0.5; CompType: Resistor; LatestRevisionDate: 2017-03-09; PartNumber: ERJ-2RKF2673X; ComponentLink1Description: Datasheet link; Supplier Part Number 1: P267KLCT-ND; Technology: Thick Film
R9 = CMP-0025952-1: RES, 102 k, 1%, 0.063 W, 0402; Manufacturer: Vishay-Dale; Power_W: 63mW; TempCo: 100 ppm/C; U/M: EA; Value: 102k; EIA_Code: E96; SizeX_mm: 1; SizeY_mm: 0.5; SizeZ_mm: 0.6; Value2: 0.063W; VDC_V: 50V; AEC Category: Q200; ComponentLink1URL: http://www.vishay.com/docs/20035/dcrcwe3.pdf; Supplier Part Number 2: 52K6611; Publisher: Texas Instruments; Supplier 2: Newark; Supplier Part Number 3: 71-CRCW0402-102K-E3; Supplier 3: Mouser; Published: 2008-06-26; Value_Code: 102k; RoHS: Y; Value1: 1%; MountType: SMT; Supplier 1: Digi-Key; PackageReference: 0402; Tolerance_%: 1%; Res_ohm: 102k; SizeArea_mm2: 0.5; CompType: Resistor; LatestRevisionDate: 2017-03-09; PartNumber: CRCW0402102KFKED; AEC Qualified: ?; ComponentLink1Description: Datasheet link; Supplier Part Number 1: 541-102KLCT-ND; Technology: Thick Film
R10 R13 = CMP-0026647-2: RES, 0.1, 1%, 0.125 W, AEC-Q200 Grade 0, 0402; Manufacturer: Panasonic; Power_W: 125mW; TempCo: 300 ppm/C; Value_Code: R100; Value: 0.1; EIA_Code: E96; SizeX_mm: 1; SizeY_mm: 0.5; SizeZ_mm: 0.6; Value2: 0.125W; AEC Qualified: Y; AEC Category: Q200; AEC Grade: 0; SizeAreaWB_mm2: 3; ComponentLink1URL: https://industrial.panasonic.com/cdbs/www-data/pdf/RDN0000/AOA0000C313.pdf; Supplier Part Number 2: 667-ERJ-2BSFR10X; Supplier 2: Mouser; RoHS: Y; Value1: 1%; MountType: SMT; Supplier 1: Digi-Key; PackageReference: 0402; Tolerance_%: 1%; Res_ohm: 0.1; SizeArea_mm2: 0.5; CompType: Resistor; PartNumber: ERJ-2BSFR10X; ComponentLink1Description: Datasheet link; Supplier Part Number 1: P.10AKCT-ND; Technology: Thick Film
R11 = CMP-0026535-2: RES, 71.5 k, 1%, 0.063 W, AEC-Q200 Grade 0, 0402; Manufacturer: Vishay-Dale; Power_W: 63mW; TempCo: 100 ppm/C; Value_Code: 71k5; Value: 71.5k; EIA_Code: E96; SizeX_mm: 1; SizeY_mm: 0.5; SizeZ_mm: 0.6; Value2: 0.063W; AEC Qualified: Y; VDC_V: 50V; AEC Category: Q200; AEC Grade: 0; ComponentLink1URL: http://www.vishay.com/docs/20035/dcrcwe3.pdf; Supplier Part Number 2: 52K7250; Supplier 2: Newark; Supplier Part Number 3: 71-CRCW0402-71.5K-E3; Supplier 3: Mouser; RoHS: E; Value1: 1%; MountType: SMT; Supplier 1: Digi-Key; PackageReference: 0402; Tolerance_%: 1%; Res_ohm: 71.5k; SizeArea_mm2: 0.5; CompType: Resistor; PartNumber: CRCW040271K5FKED; ComponentLink1Description: Datasheet link; Supplier Part Number 1: 541-71.5KLCT-ND; Technology: Thick Film
R12 = CMP-0026441-2: RES, 52.3 k, 1%, 0.063 W, AEC-Q200 Grade 0, 0402; Manufacturer: Vishay-Dale; Power_W: 63mW; TempCo: 100 ppm/C; Value_Code: 52k3; Value: 52.3k; EIA_Code: E96; SizeX_mm: 1; SizeY_mm: 0.5; SizeZ_mm: 0.6; Value2: 0.063W; AEC Qualified: Y; VDC_V: 50V; AEC Category: Q200; AEC Grade: 0; ComponentLink1URL: http://www.vishay.com/docs/20035/dcrcwe3.pdf; Supplier Part Number 2: 52K7137; Supplier 2: Newark; Supplier Part Number 3: 71-CRCW0402-52.3K-E3; Supplier 3: Mouser; RoHS: E; Value1: 1%; MountType: SMT; Supplier 1: Digi-Key; PackageReference: 0402; Tolerance_%: 1%; Res_ohm: 52.3k; SizeArea_mm2: 0.5; CompType: Resistor; PartNumber: CRCW040252K3FKED; ComponentLink1Description: Datasheet link; Supplier Part Number 1: 541-52.3KLCT-ND; Technology: Thick Film
R14 = CMP-0026100-2: as R4 on sheet TIDA-PowerNB_BuckBoost; ComponentLink1URL: http://www.vishay.com/docs/20035/dcrcwe3.pdf; Supplier Part Number 2: 52K6593; Supplier 2: Newark; Supplier Part Number 3: 71-CRCW0402-1.0M-E3; Supplier 3: Mouser; RoHS: E; Value1: 1%; MountType: SMT; Supplier 1: Digi-Key; PackageReference: 0402; Tolerance_%: 1%; SizeArea_mm2: 0.5; CompType: Resistor; PartNumber: CRCW04021M00FKED; ComponentLink1Description: Datasheet link; Supplier Part Number 1: 541-1.00MLCT-ND; Technology: Thick Film
U3 = CMP-0081431-3: Ultra low IQ Step Down Converter, DLC0008A (VSON-HR-8); Alternate Manufacturer: Texas Instruments; SizeAreaWB_mm2: 7.5; SizeZ_mm: 1; SizeX_mm: 1.5; SizeY_mm: 2; SizeArea_mm2: 3; CompType: IC; AEC Qualified: N; AEC Category: Q200; ComponentLink1URL: http://www.ti.com/lit/ds/symlink/tps62840.pdf; PackageDescription: VSON-HR-8; MountType: SMT; ComponentLink2URL: http://www.ti.com/product/tps62840; ComponentLink3Description: Online Datasheet; ComponentLink2Description: Product Folder; Manufacturer: Texas Instruments; ComponentLink3URL: http://www.ti.com/product/tps62840/datasheet; PackageReference: DLC0008A; PartNumber: TPS62840DLCR; ComponentLink1Description: Datasheet Link; Operating Temperature Range: -40 to 125 C

## Sheet TIDA-PowerNBIoT_CoverSheet.SchDoc
size 431 x 279 mm; Date: Not shown in title block; ApprovedBy: Not shown in title block; CheckedBy: Not shown in title block; Author: Not shown in title block; CompanyName: Not shown in title block; Engineer: Not shown in title block; Organization: Not shown in title block; Address1: Not shown in title block; Address2: Not shown in title block; Address3: Not shown in title block; Address4: Not shown in title block; DocumentNumber: 1; Revision: Use project parameter SCH_Rev; SheetNumber: 1; SheetTotal: 3; PageSetup: Record=PageOptions|CenterHorizontal=True|CenterVertical=True|PrintScale=1.00|XCorrection=1.00|YCorrection=1.00|PrintKind=0|BorderSize=5000000|LeftOffset=0|BottomOffset=0|Orientation=2|PaperLength=1000|PaperWidth=1000|Scale=100|PaperSource=15|PrintQuality=600|MediaType=1|DitherType=10|PaperKind=Letter|PrintScaleMode=1; CurrentTime: Not shown in title block; CurrentDate: Not shown in title block; Time: Not shown in title block; DocumentFullPathAndName: Not shown in title block; DocumentName: Not shown in title block; ModifiedDate: Not shown in title block; ImagePath: Not shown in title block
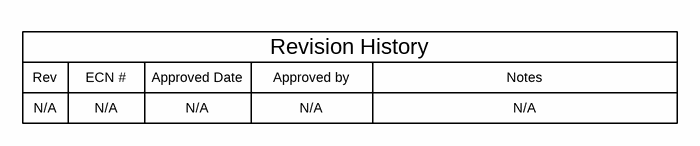
[diagram p2: TIDA-PowerNBIoT_CoverSheet.SchDoc]

### Notes on the sheet
- Rev
- N/A
- ECN #
- Approved Date
- Approved by
- Revision History
- Notes
- Drawn By:
- SVN Rev:
- Number:
- TID #:
- Orderable:
- Rev:
- Sheet Title:
- File:
- Project Title:
- Designed for:
- Assembly Variant:
- Mod. Date:
- Sheet:
- Size:
- of
- B
- http://www.ti.com
- Texas Instruments and/or its licensors do not warrant the accuracy or completeness of this specification or any information contained therein. Texas Instruments and/or its licensors do not warrant that this design will meet the specifications, will be suitable for your application or fit for any particular purpose, or will operate in an implementation. Texas Instruments and/or its licensors do not warrant that the design is production worthy. You should completely validate and test your design implementation to confirm the system functionality for your application.
- Engineer:
- Contact:
- © Texas Instruments

## Sheet TIDA-PowerNBIoT_Boost.SchDoc
size 431 x 279 mm; Date: Not shown in title block; ApprovedBy: Not shown in title block; CheckedBy: Not shown in title block; Author: Not shown in title block; CompanyName: Not shown in title block; Engineer: Not shown in title block; Organization: Not shown in title block; Address1: Not shown in title block; Address2: Not shown in title block; Address3: Not shown in title block; Address4: Not shown in title block; DocumentNumber: 1; Revision: Use project parameter SCH_Rev; SheetNumber: 2; SheetTotal: 3; PageSetup: Record=PageOptions|CenterHorizontal=True|CenterVertical=True|PrintScale=1.00|XCorrection=1.00|YCorrection=1.00|PrintKind=0|BorderSize=5000000|LeftOffset=0|BottomOffset=0|Orientation=2|PaperLength=1000|PaperWidth=1000|Scale=100|PaperSource=15|PrintQuality=600|MediaType=1|DitherType=10|PaperKind=Letter|PrintScaleMode=1; CurrentTime: Not shown in title block; CurrentDate: Not shown in title block; Time: Not shown in title block; DocumentFullPathAndName: Not shown in title block; DocumentName: Not shown in title block; ModifiedDate: Not shown in title block; ImagePath: Not shown in title block
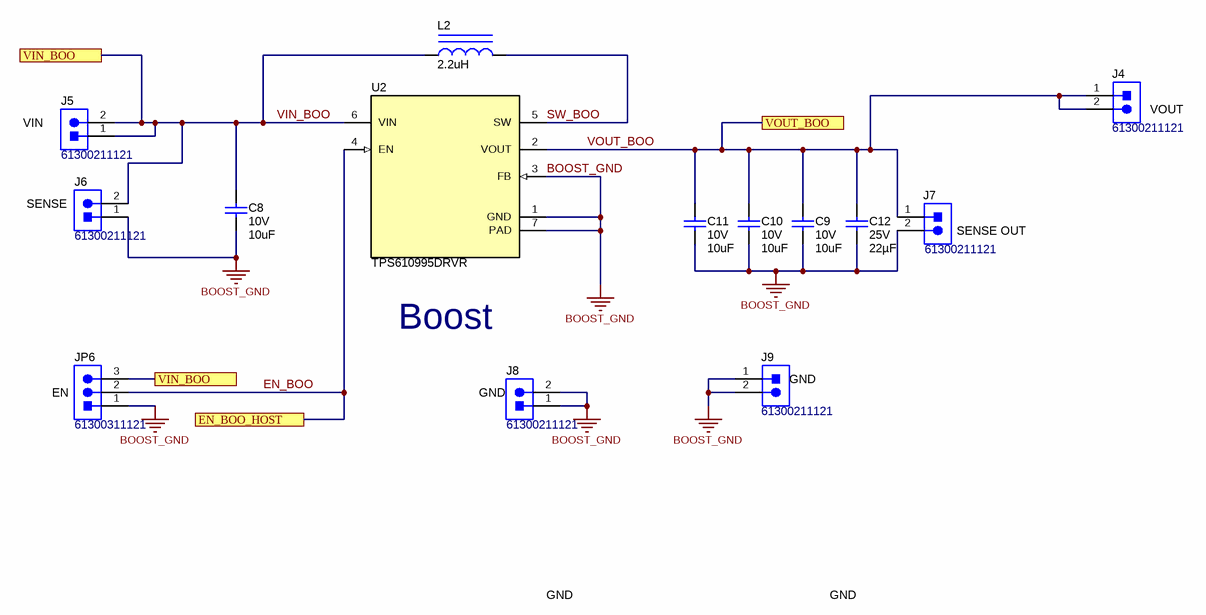
[diagram p3: TIDA-PowerNBIoT_Boost.SchDoc]

### Parts
C8  VDC_V: 10V  ValueDisplayed: 10uF  [0603]  (hidden comment: GRM188Z71A106MA73D)
C9  VDC_V: 10V  ValueDisplayed: 10uF  [0603]  (hidden comment: GRM188Z71A106MA73D)
C10  VDC_V: 10V  ValueDisplayed: 10uF  [0603]  (hidden comment: GRM188Z71A106MA73D)
C11  VDC_V: 10V  ValueDisplayed: 10uF  [0603]  (hidden comment: GRM188Z71A106MA73D)
C12  VDC_V: 25V  ValueDisplayed: 22µF  [0805_HV]  (hidden comment: TMK212B7225KG-TR)
J4  61300211121  [WURTH_61300211121]
J5  61300211121  [WURTH_61300211121]
J6  61300211121  [WURTH_61300211121]
J7  61300211121  [WURTH_61300211121]
J8  61300211121  [WURTH_61300211121]
J9  61300211121  [WURTH_61300211121]
JP6  61300311121  [WURTH_61300311121]
L2  ValueDisplayed: 2.2uH  [WE_LQS_252012]  (hidden comment: 74404024022)
U2  TPS610995DRVR  [DRV0006A]

### Ports
EN_BOO_HOST, VIN_BOO, VOUT_BOO

### Nets
BOOST_GND: C8.2 C9.2 C10.2 C11.2 C12.2 J6.1 J7.2 J8.1 J8.2 J9.1 J9.2 JP6.1 U2.1(GND) U2.3(FB) U2.7(PAD)
EN_BOO: JP6.2 U2.4(EN) ; port EN_BOO_HOST
SW_BOO: L2.2 U2.5(SW)
VIN_BOO: C8.1 J5.1 J5.2 J6.2 JP6.3 L2.1 U2.6(VIN) ; port VIN_BOO
VOUT_BOO: C9.1 C10.1 C11.1 C12.1 J4.1 J4.2 J7.1 U2.2(VOUT) ; port VOUT_BOO

### Notes on the sheet
- (near J5) VIN
- (near J4) VOUT
- (near J6) SENSE
- (near J7) SENSE OUT
- (near JP6) EN
- Boost
- (near J8) GND
- (near J9) GND
- GND
- Drawn By:
- SVN Rev:
- Number:
- TID #:
- Orderable:
- Rev:
- Sheet Title:
- File:
- Project Title:
- Designed for:
- Assembly Variant:
- Mod. Date:
- Sheet:
- Size:
- of
- B
- http://www.ti.com
- Texas Instruments and/or its licensors do not warrant the accuracy or completeness of this specification or any information contained therein. Texas Instruments and/or its licensors do not warrant that this design will meet the specifications, will be suitable for your application or fit for any particular purpose, or will operate in an implementation. Texas Instruments and/or its licensors do not warrant that the design is production worthy. You should completely validate and test your design implementation to confirm the system functionality for your application.
- Engineer:
- Contact:
- © Texas Instruments

### Library data of the parts
C8-C11 = CMP-0007497-5: CAP, CERM, 10 uF, 10 V, +/- 20%, X7R, 0603; Manufacturer: MuRata; TaMin_C: -55°C; Polarized: N; SizeAreaWB_mm2: 4.68; Value1: Unknown; U/M: EA; Value: 10uF; TaMax_C: 125°C; SizeZ_mm: 1; SizeX_mm: 1.6; SizeY_mm: 0.8; SizeArea_mm2: 1.28; CompType: Capacitor; Cap_F: 10µF; AEC Category: Q200; Publisher: Texas Instruments; TempCo: X7R; Published: 2008-06-19; RoHS: Y; MountType: SMT; Supplier 1: Mouser; PackageReference: 0603; Tolerance_%: 20%; Cap_Case: 0603; Value2: 10V; LatestRevisionDate: 2017-03-09; PartNumber: GRM188Z71A106MA73D; AEC Qualified: N; ComponentLink1Description: Datasheet link; AEC Grade: N/A; Supplier Part Number 1: 81-GRM188Z71A106MA3D; Technology: Ceramic; ComponentLink1URL: http://psearch.en.murata.com/capacitor/product/GRM188Z71A106MA73%23.pdf
C12 = CMP-0080705-1: CAP, CERM, 22 µF, 25 V,+/- 10%, X7R, 0805; Manufacturer: Taiyo Yuden; SizeAreaWB_mm2: 6.75; SizeArea_mm2: 2.5; AEC Qualified: N; AEC Category: Q200; Value: 22uF; TaMax_C: 125°C; SizeZ_mm: 1.45; TaMin_C: -55°C; SizeY_mm: 1.25; U/M: EA; CompType: Capacitor; SizeX_mm: 2; Cap_Case: 0805; ComponentLink1Description: Datasheet link; Cap_F: 22µF; RoHS: Y; Supplier Part Number 3: 963-TMK212B7225KG-TR; Tolerance_%: 10%; Supplier 1: Digi-Key; PackageReference: 0805; Technology: Ceramic; PartNumber: TMK212B7225KG-TR; TempCo: X7R; Supplier Part Number 2: 92T9715; Supplier 2: Newark; AEC Grade: N/A; Polarized: N; Value2: 25V; ComponentLink1URL: https://www.yuden.co.jp/productdata/catalog/mlcc_all_e.pdf; MountType: SMT; Supplier Part Number 1: 587-2991-1-ND; Supplier 3: Mouser
J4-J9 = CMP-0054794-2: as J3 on sheet TIDA-PowerNB_BuckBoost; Supplier Part Number 2: 20X0948; Orientation: Vertical; PinCount: 2; ClassName: Header; Supplier 2: Newark; PackageReference: Header, 2.54mm, 2x1, TH; CompType: Header; ComponentLink1Description: Datasheet URL; Supplier 1: Digi-Key; Green_EU RoHS-2: Incomplete; ComponentLink1URL: http://katalog.we-online.de/em/datasheet/6130xx11121.pdf; Green_EU RoHS: Passed; MountType: TH; Supplier Part Number 3: 710-61300211121; RoHS: Y; Supplier Part Number 1: 732-5315-ND; ContactFinish: Gold; Supplier 3: Mouser; PartNumber: 61300211121; Color: Black
JP6 = CMP-0054796-2: as JP1 on sheet TIDA-PowerNB_BuckBoost; MountType: TH; Supplier Part Number 1: 732-5316-ND; PinCount: 3; Color: Black; ClassName: Header; Supplier Part Number 3: 356154; ContactFinish: Gold; ComponentLink1Description: Datasheet URL; ComponentLink1URL: http://katalog.we-online.de/em/datasheet/6130xx11121.pdf; PackageReference: Header, 2.54mm, 3x1, TH; Supplier Part Number 2: 20X0950; Green_EU RoHS-2: Incomplete; CompType: Header; Green_EU RoHS: Passed; Orientation: Vertical; RoHS: Y; PartNumber: 61300311121; Supplier 2: Newark; Supplier 1: Digi-Key; Supplier 3: Farnell
L2 = CMP-0063791-1: Inductor, Wirewound, Ferrite, 2.2 uH, 1.8 A, 0.08 ohm, SMD; Manufacturer: Wurth Elektronik; Isat: 1.95A @ 30% inductance drop; Irms: 1.8A @ 40C rise; Green_Lifecycle: Active; SizeAreaWB_mm2: 10.5; DCR_ohm: 0.08; Green_REACh: Passed; Value: 2.2uH; Imax_A: 1.8A; SizeZ_mm: 1.2; SizeX_mm: 2.5; SizeY_mm: 2; SizeArea_mm2: 5; Ind_H: 2.2µH; AEC Qualified: N; AEC Category: Q200; ComponentLink1URL: http://katalog.we-online.de/pbs/datasheet/74404024022.pdf; Supplier Part Number 2: 75X1095; Publisher: Texas Instruments; Supplier 2: Newark; Supplier Part Number 3: 710-74404024022; Supplier 3: Mouser; Published: 2008-06-26; RoHS: Y; Value1: 0.08 ohm; Material: Ferrite; MountType: SMT; Green_EU RoHS-2: Incomplete; Supplier 1: Digi-Key; Green_EU RoHS: Passed; PackageReference: SMD, 2.5x2mm; Value2: 1.8A; CompType: Inductor; LatestRevisionDate: 2017-06-02; PartNumber: 74404024022; ComponentLink1Description: Datasheet link; AEC Grade: N/A; Supplier Part Number 1: 732-5436-1-ND; Technology: Wirewound
U2 = CMP-0079929-1: Synchronous Boost Converter with 800 nA Ultra-Low Quiescent Current, DRV0006A (WSON-6); Alternate PartNumber: TPS610995DRVT; Alternate Manufacturer: Texas Instruments; SizeAreaWB_mm2: 9; SizeZ_mm: 0.8; SizeX_mm: 2; SizeArea_mm2: 4; CompType: IC; AEC Qualified: N; AEC Category: Q200; ComponentLink1URL: http://www.ti.com/lit/ds/symlink/tps61099.pdf; PackageDescription: WSON-6; MountType: SMT; ComponentLink2URL: http://www.ti.com/product/tps61099; ComponentLink3Description: Online Datasheet; ComponentLink2Description: Product Folder; Manufacturer: Texas Instruments; ComponentLink3URL: http://www.ti.com/product/tps61099/datasheet; PackageReference: DRV0006A; SizeY_mm: 2; PartNumber: TPS610995DRVR; ComponentLink1Description: Datasheet Link